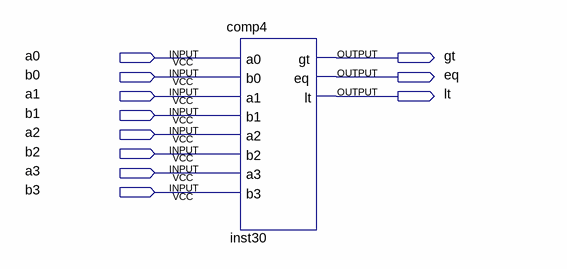
[diagram p0: schematic sheet]
// Quartus schematic lab41.bdf as structural Verilog: 1 symbols, 11 pins
module lab41 (
  input  a0,
  input  b0,
  input  a1,
  input  b1,
  input  a2,
  input  b2,
  input  a3,
  input  b3,
  output gt,
  output eq,
  output lt
);

  comp4 inst30 (.a0(a0), .b0(b0), .a1(a1), .b1(b1), .a2(a2), .b2(b2), .a3(a3), .b3(b3), .gt(gt), .eq(eq), .lt(lt));
endmodule
